# EAGLE design KAC12040_sfe_v0.1 (EAGLE 6.5.2)

## Sheet 1 of 3
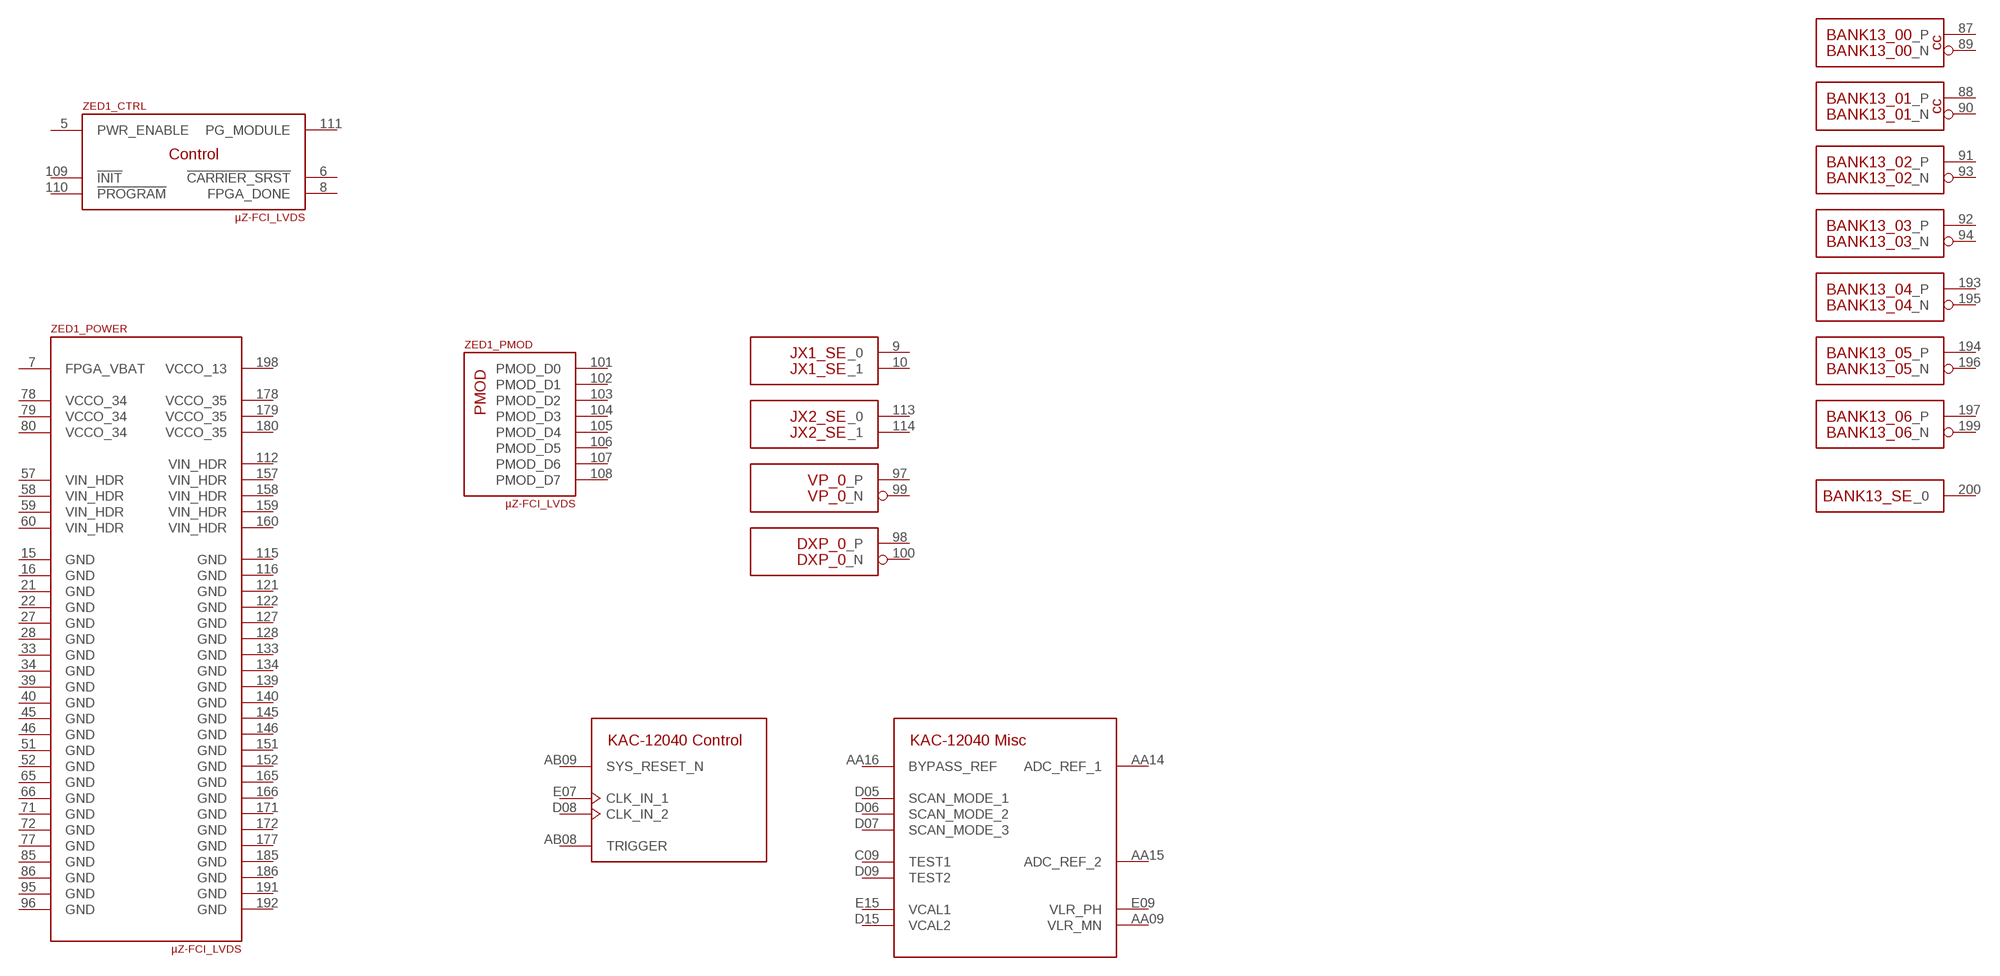
[diagram p0: schematic, sheet 1]

### Parts
U$1  KAC-12040  [KAC-12040-400T4]
ZED1  µZ-FCI_LVDS  [µZ]
Unconnected: U$1.A01(_NC:NC) U$1.A15(_BANK5:LVDS_0_P) U$1.A16(_BANK5:LVDS_1_P) U$1.A17(_BANK5:LVDS_2_P) U$1.A18(_BANK5:LVDS_3_P) U$1.A19(_BANK5:LVDS_4_P) U$1.A20(_BANK5:LVDS_5_P) U$1.A21(_BANK5:LVDS_6_P) U$1.A22(_BANK7:CLK_P) U$1.A23(_BANK7:LVDS_0_P) U$1.A24(_BANK7:LVDS_1_P) U$1.A25(_BANK7:LVDS_2_P) U$1.AA05(_SPI:SPI_CLK) U$1.AA06(_SPI:SPI_EN) U$1.AA07(_SPI:SPI_OUT) U$1.AA08(_SPI:SPI_IN) U$1.AA09(_MISC:VLR_MN) U$1.AA14(_MISC:ADC_REF_1) U$1.AA15(_MISC:ADC_REF_2) U$1.AA16(_MISC:BYPASS_REF) U$1.AA26(_BANK6:LVDS_6_P) U$1.AA27(_BANK6:LVDS_6_N) U$1.AB05(_NC:NC) U$1.AB06(_DIGOUT:FLASH_OUT) U$1.AB07(_DIGOUT:MECH_SHUT_OUT) U$1.AB08(_CTRL:TRIGGER) U$1.AB09(_CTRL:SYS_RESET_N) U$1.AB26(_BANK6:LVDS_5_P) U$1.AB27(_BANK6:LVDS_5_N) U$1.AC09(_NC:NC) U$1.AC15(_BANK4:CLK_P) U$1.AC16(_BANK4:CLK_N) U$1.AC26(_BANK6:LVDS_4_P) U$1.AC27(_BANK6:LVDS_4_N) U$1.AD15(_BANK4:LVDS_0_N) U$1.AD16(_BANK4:LVDS_1_N) U$1.AD17(_BANK4:LVDS_2_N) U$1.AD18(_BANK4:LVDS_3_N) U$1.AD19(_BANK4:LVDS_4_N) U$1.AD20(_BANK4:LVDS_5_N) U$1.AD21(_BANK4:LVDS_6_N) U$1.AD22(_BANK6:CLK_N) U$1.AD23(_BANK6:LVDS_0_N) U$1.AD24(_BANK6:LVDS_1_N) U$1.AD25(_BANK6:LVDS_2_N) U$1.AD26(_BANK6:LVDS_3_P) U$1.AD27(_BANK6:LVDS_3_N) U$1.AE15(_BANK4:LVDS_0_P) U$1.AE16(_BANK4:LVDS_1_P) U$1.AE17(_BANK4:LVDS_2_P) U$1.AE18(_BANK4:LVDS_3_P) U$1.AE19(_BANK4:LVDS_4_P) U$1.AE20(_BANK4:LVDS_5_P) U$1.AE21(_BANK4:LVDS_6_P) U$1.AE22(_BANK6:CLK_P) U$1.AE23(_BANK6:LVDS_0_P) U$1.AE24(_BANK6:LVDS_1_P) U$1.AE25(_BANK6:LVDS_2_P) U$1.B15(_BANK5:LVDS_0_N) U$1.B16(_BANK5:LVDS_1_N) U$1.B17(_BANK5:LVDS_2_N) U$1.B18(_BANK5:LVDS_3_N) U$1.B19(_BANK5:LVDS_4_N) U$1.B20(_BANK5:LVDS_5_N) U$1.B21(_BANK5:LVDS_6_N) U$1.B22(_BANK7:CLK_N) U$1.B23(_BANK7:LVDS_0_N) U$1.B24(_BANK7:LVDS_1_N) U$1.B25(_BANK7:LVDS_2_N) U$1.B26(_BANK7:LVDS_3_N) U$1.B27(_BANK7:LVDS_3_P) U$1.C09(_MISC:TEST1) U$1.C15(_BANK5:CLK_P) U$1.C16(_BANK5:CLK_N) U$1.C26(_BANK7:LVDS_4_N) U$1.C27(_BANK7:LVDS_4_P) U$1.D05(_MISC:SCAN_MODE_1) U$1.D06(_MISC:SCAN_MODE_2) U$1.D07(_MISC:SCAN_MODE_3) U$1.D08(_CTRL:CLK_IN_2) U$1.D09(_MISC:TEST2) U$1.D15(_MISC:VCAL2) U$1.D26(_BANK7:LVDS_5_N) U$1.D27(_BANK7:LVDS_5_P) U$1.E05(_DIGOUT:FRAME_EN_OUT) U$1.E06(_DIGOUT:LINE_EN_OUT) U$1.E07(_CTRL:CLK_IN_1) U$1.E09(_MISC:VLR_PH) U$1.E14(_NC:NC) U$1.E15(_MISC:VCAL1) U$1.E16(_NC:NC) U$1.E26(_BANK7:LVDS_6_N) U$1.E27(_BANK7:LVDS_6_P) ZED1.1(_JTAG:TCK) ZED1.2(_JTAG:TMS) ZED1.3(_JTAG:TDO) ZED1.4(_JTAG:TDI) ZED1.5(_CTRL:PWR_ENABLE) ZED1.6(_CTRL:!CARRIER_SRST) ZED1.8(_CTRL:FPGA_DONE) ZED1.9(JX1_SE:_0) ZED1.10(JX1_SE:_1) ZED1.87(BANK13_00:_P) ZED1.88(BANK13_01:_P) ZED1.89(BANK13_00:_N) ZED1.90(BANK13_01:_N) ZED1.91(BANK13_02:_P) ZED1.92(BANK13_03:_P) ZED1.93(BANK13_02:_N) ZED1.94(BANK13_03:_N) ZED1.97(VP_0:_P) ZED1.98(DXP_0:_P) ZED1.99(VP_0:_N) ZED1.100(DXP_0:_N) ZED1.101(_PMOD:PMOD_D0) ZED1.102(_PMOD:PMOD_D1) ZED1.103(_PMOD:PMOD_D2) ZED1.104(_PMOD:PMOD_D3) ZED1.105(_PMOD:PMOD_D4) ZED1.106(_PMOD:PMOD_D5) ZED1.107(_PMOD:PMOD_D6) ZED1.108(_PMOD:PMOD_D7) ZED1.109(_CTRL:!INIT) ZED1.110(_CTRL:!PROGRAM) ZED1.111(_CTRL:PG_MODULE) ZED1.113(JX2_SE:_0) ZED1.114(JX2_SE:_1) ZED1.193(BANK13_04:_P) ZED1.194(BANK13_05:_P) ZED1.195(BANK13_04:_N) ZED1.196(BANK13_05:_N) ZED1.197(BANK13_06:_P) ZED1.199(BANK13_06:_N) ZED1.200(BANK13_SE:_0)

## Sheet 2 of 3
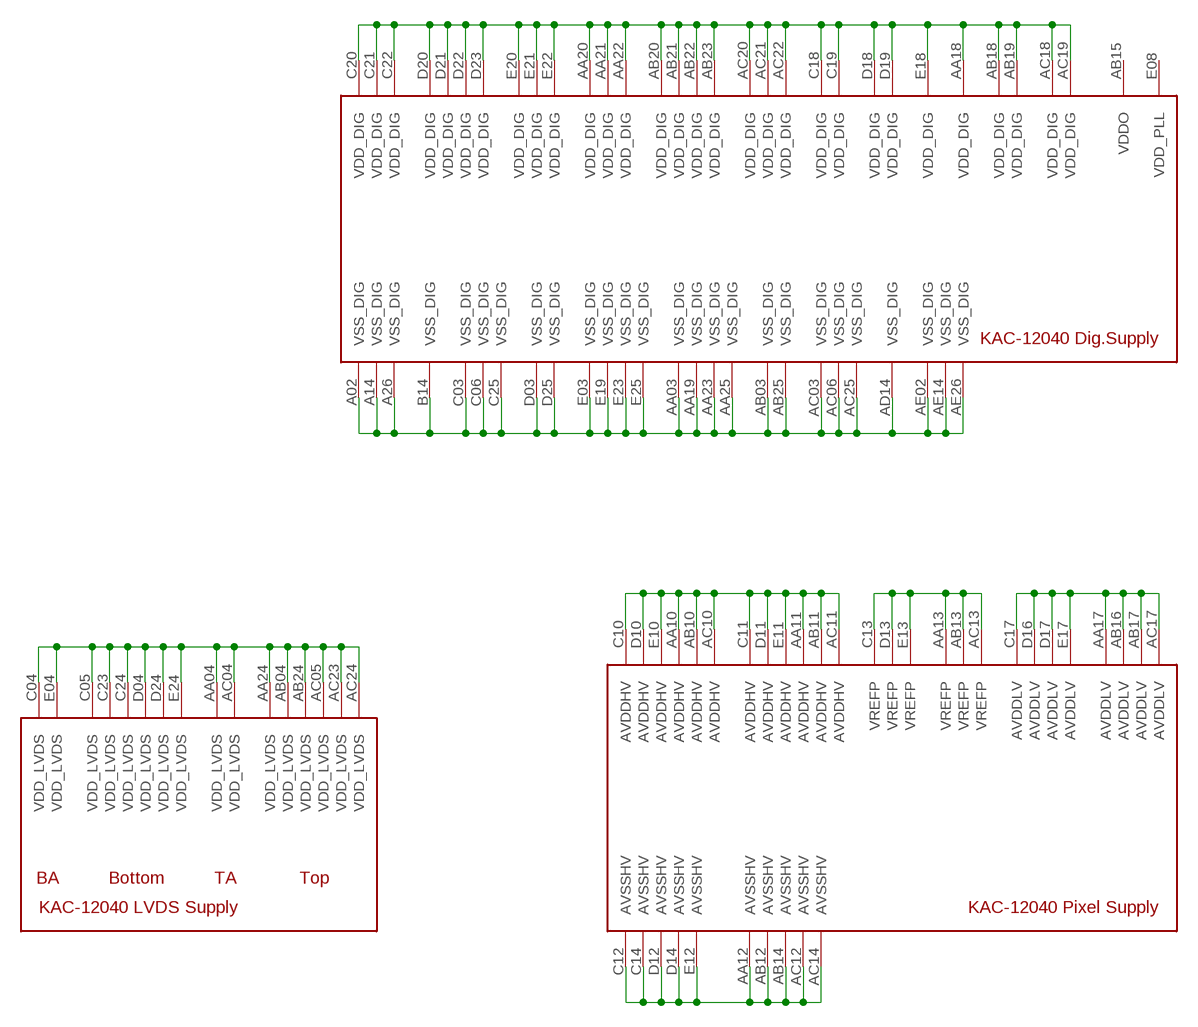
[diagram p1: schematic, sheet 2]

### Nets
N$1: U$1.AA18(_PWR_DIG:VDD_DIG) U$1.AA20(_PWR_DIG:VDD_DIG) U$1.AA21(_PWR_DIG:VDD_DIG) U$1.AA22(_PWR_DIG:VDD_DIG) U$1.AB18(_PWR_DIG:VDD_DIG) U$1.AB19(_PWR_DIG:VDD_DIG) U$1.AB20(_PWR_DIG:VDD_DIG) U$1.AB21(_PWR_DIG:VDD_DIG) U$1.AB22(_PWR_DIG:VDD_DIG) U$1.AB23(_PWR_DIG:VDD_DIG) U$1.AC18(_PWR_DIG:VDD_DIG) U$1.AC19(_PWR_DIG:VDD_DIG) U$1.AC20(_PWR_DIG:VDD_DIG) U$1.AC21(_PWR_DIG:VDD_DIG) U$1.AC22(_PWR_DIG:VDD_DIG) U$1.C18(_PWR_DIG:VDD_DIG) U$1.C19(_PWR_DIG:VDD_DIG) U$1.C20(_PWR_DIG:VDD_DIG) U$1.C21(_PWR_DIG:VDD_DIG) U$1.C22(_PWR_DIG:VDD_DIG) U$1.D18(_PWR_DIG:VDD_DIG) U$1.D19(_PWR_DIG:VDD_DIG) U$1.D20(_PWR_DIG:VDD_DIG) U$1.D21(_PWR_DIG:VDD_DIG) U$1.D22(_PWR_DIG:VDD_DIG) U$1.D23(_PWR_DIG:VDD_DIG) U$1.E18(_PWR_DIG:VDD_DIG) U$1.E20(_PWR_DIG:VDD_DIG) U$1.E21(_PWR_DIG:VDD_DIG) U$1.E22(_PWR_DIG:VDD_DIG)
N$2: U$1.AA13(_PWR_PIXEL:VREFP) U$1.AB13(_PWR_PIXEL:VREFP) U$1.AC13(_PWR_PIXEL:VREFP) U$1.C13(_PWR_PIXEL:VREFP) U$1.D13(_PWR_PIXEL:VREFP) U$1.E13(_PWR_PIXEL:VREFP)
N$3: U$1.A02(_PWR_DIG:VSS_DIG) U$1.A14(_PWR_DIG:VSS_DIG) U$1.A26(_PWR_DIG:VSS_DIG) U$1.AA03(_PWR_DIG:VSS_DIG) U$1.AA19(_PWR_DIG:VSS_DIG) U$1.AA23(_PWR_DIG:VSS_DIG) U$1.AA25(_PWR_DIG:VSS_DIG) U$1.AB03(_PWR_DIG:VSS_DIG) U$1.AB25(_PWR_DIG:VSS_DIG) U$1.AC03(_PWR_DIG:VSS_DIG) U$1.AC06(_PWR_DIG:VSS_DIG) U$1.AC25(_PWR_DIG:VSS_DIG) U$1.AD14(_PWR_DIG:VSS_DIG) U$1.AE02(_PWR_DIG:VSS_DIG) U$1.AE14(_PWR_DIG:VSS_DIG) U$1.AE26(_PWR_DIG:VSS_DIG) U$1.B14(_PWR_DIG:VSS_DIG) U$1.C03(_PWR_DIG:VSS_DIG) U$1.C06(_PWR_DIG:VSS_DIG) U$1.C25(_PWR_DIG:VSS_DIG) U$1.D03(_PWR_DIG:VSS_DIG) U$1.D25(_PWR_DIG:VSS_DIG) U$1.E03(_PWR_DIG:VSS_DIG) U$1.E19(_PWR_DIG:VSS_DIG) U$1.E23(_PWR_DIG:VSS_DIG) U$1.E25(_PWR_DIG:VSS_DIG)
N$4: U$1.AA10(_PWR_PIXEL:AVDDHV) U$1.AA11(_PWR_PIXEL:AVDDHV) U$1.AB10(_PWR_PIXEL:AVDDHV) U$1.AB11(_PWR_PIXEL:AVDDHV) U$1.AC10(_PWR_PIXEL:AVDDHV) U$1.AC11(_PWR_PIXEL:AVDDHV) U$1.C10(_PWR_PIXEL:AVDDHV) U$1.C11(_PWR_PIXEL:AVDDHV) U$1.D10(_PWR_PIXEL:AVDDHV) U$1.D11(_PWR_PIXEL:AVDDHV) U$1.E10(_PWR_PIXEL:AVDDHV) U$1.E11(_PWR_PIXEL:AVDDHV)
N$65: U$1.AA17(_PWR_PIXEL:AVDDLV) U$1.AB16(_PWR_PIXEL:AVDDLV) U$1.AB17(_PWR_PIXEL:AVDDLV) U$1.AC17(_PWR_PIXEL:AVDDLV) U$1.C17(_PWR_PIXEL:AVDDLV) U$1.D16(_PWR_PIXEL:AVDDLV) U$1.D17(_PWR_PIXEL:AVDDLV) U$1.E17(_PWR_PIXEL:AVDDLV)
N$66: U$1.AA12(_PWR_PIXEL:AVSSHV) U$1.AB12(_PWR_PIXEL:AVSSHV) U$1.AB14(_PWR_PIXEL:AVSSHV) U$1.AC12(_PWR_PIXEL:AVSSHV) U$1.AC14(_PWR_PIXEL:AVSSHV) U$1.C12(_PWR_PIXEL:AVSSHV) U$1.C14(_PWR_PIXEL:AVSSHV) U$1.D12(_PWR_PIXEL:AVSSHV) U$1.D14(_PWR_PIXEL:AVSSHV) U$1.E12(_PWR_PIXEL:AVSSHV)
N$67: U$1.AA04(_PWR_LVDS:VDD_LVDS) U$1.AA24(_PWR_LVDS:VDD_LVDS) U$1.AB04(_PWR_LVDS:VDD_LVDS) U$1.AB24(_PWR_LVDS:VDD_LVDS) U$1.AC04(_PWR_LVDS:VDD_LVDS) U$1.AC05(_PWR_LVDS:VDD_LVDS) U$1.AC23(_PWR_LVDS:VDD_LVDS) U$1.AC24(_PWR_LVDS:VDD_LVDS) U$1.C04(_PWR_LVDS:VDD_LVDS) U$1.C05(_PWR_LVDS:VDD_LVDS) U$1.C23(_PWR_LVDS:VDD_LVDS) U$1.C24(_PWR_LVDS:VDD_LVDS) U$1.D04(_PWR_LVDS:VDD_LVDS) U$1.D24(_PWR_LVDS:VDD_LVDS) U$1.E04(_PWR_LVDS:VDD_LVDS) U$1.E24(_PWR_LVDS:VDD_LVDS)

## Sheet 3 of 3
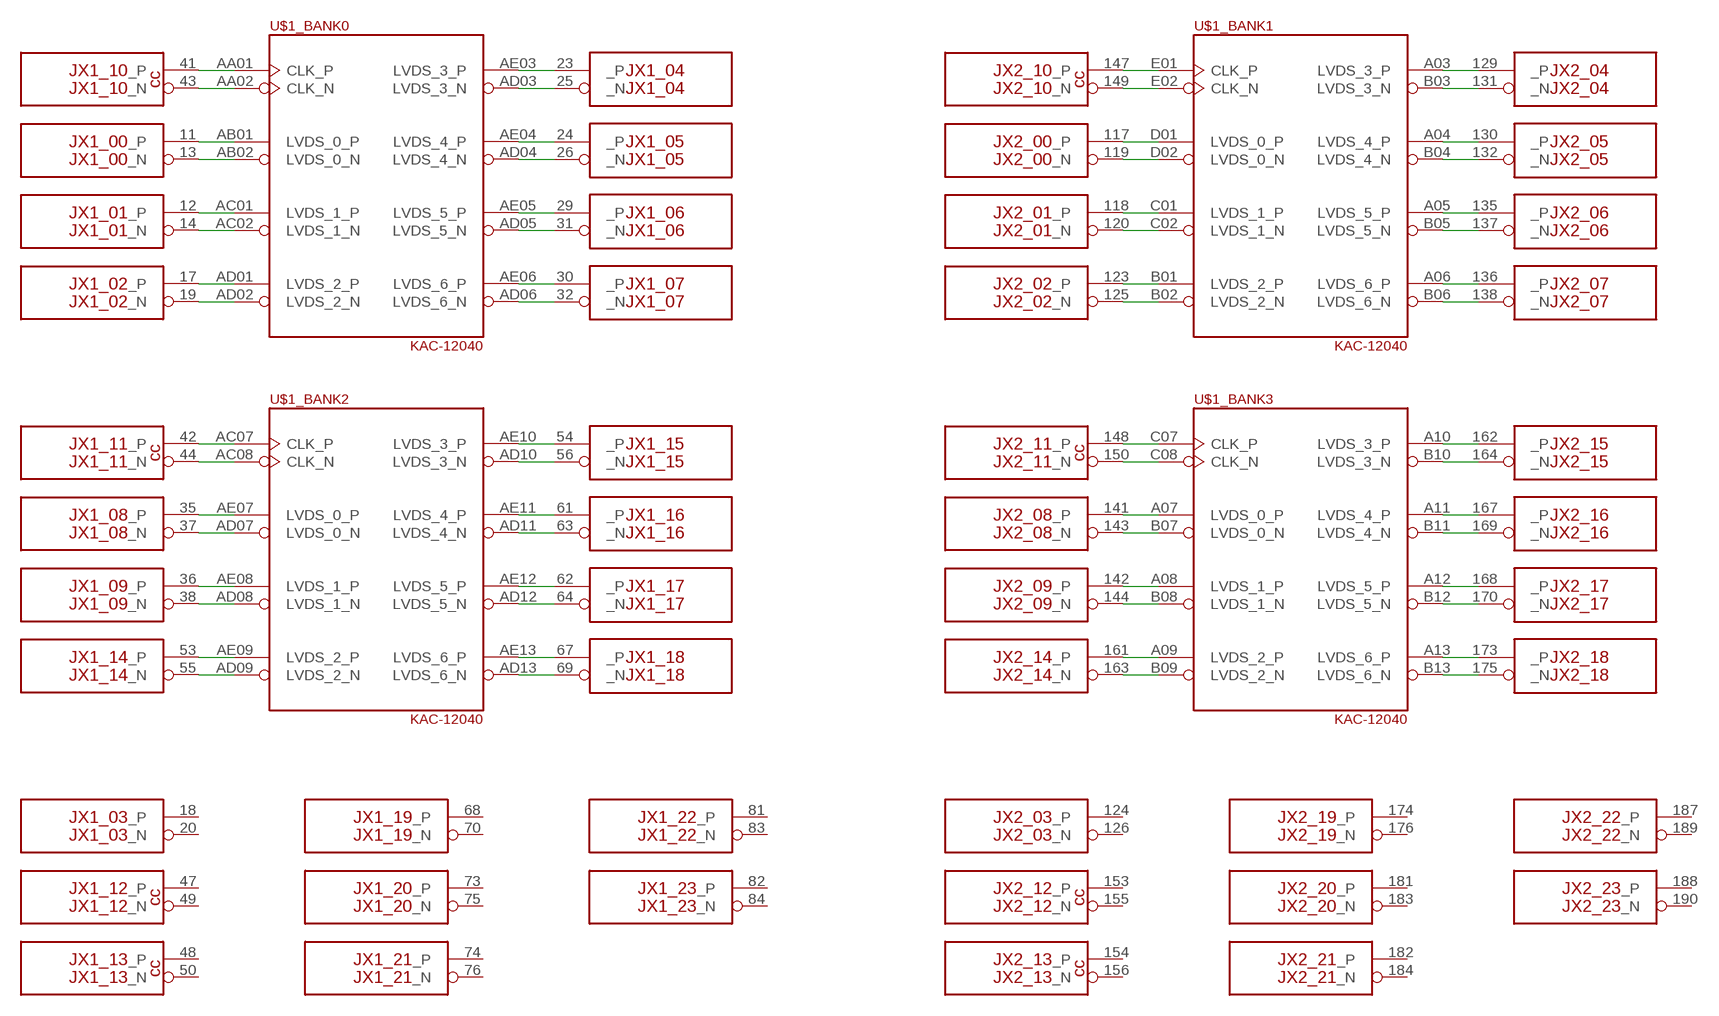
[diagram p2: schematic, sheet 3]

### Nets
C$0_N: U$1.AA02(_BANK0:CLK_N) ZED1.43(JX1_10:_N)
C$0_P: U$1.AA01(_BANK0:CLK_P) ZED1.41(JX1_10:_P)
C$1_N: U$1.E02(_BANK1:CLK_N) ZED1.149(JX2_10:_N)
C$1_P: U$1.E01(_BANK1:CLK_P) ZED1.147(JX2_10:_P)
C$2_N: U$1.AC08(_BANK2:CLK_N) ZED1.44(JX1_11:_N)
C$2_P: U$1.AC07(_BANK2:CLK_P) ZED1.42(JX1_11:_P)
C$3_N: U$1.C08(_BANK3:CLK_N) ZED1.150(JX2_11:_N)
C$3_P: U$1.C07(_BANK3:CLK_P) ZED1.148(JX2_11:_P)
L0$0_N: U$1.AB02(_BANK0:LVDS_0_N) ZED1.13(JX1_00:_N)
L0$0_P: U$1.AB01(_BANK0:LVDS_0_P) ZED1.11(JX1_00:_P)
L0$1_N: U$1.D02(_BANK1:LVDS_0_N) ZED1.119(JX2_00:_N)
L0$1_P: U$1.D01(_BANK1:LVDS_0_P) ZED1.117(JX2_00:_P)
L0$2_N: U$1.AD07(_BANK2:LVDS_0_N) ZED1.37(JX1_08:_N)
L0$2_P: U$1.AE07(_BANK2:LVDS_0_P) ZED1.35(JX1_08:_P)
L0$3_N: U$1.B07(_BANK3:LVDS_0_N) ZED1.143(JX2_08:_N)
L0$3_P: U$1.A07(_BANK3:LVDS_0_P) ZED1.141(JX2_08:_P)
L1$0_N: U$1.AC02(_BANK0:LVDS_1_N) ZED1.14(JX1_01:_N)
L1$0_P: U$1.AC01(_BANK0:LVDS_1_P) ZED1.12(JX1_01:_P)
L1$1_N: U$1.C02(_BANK1:LVDS_1_N) ZED1.120(JX2_01:_N)
L1$1_P: U$1.C01(_BANK1:LVDS_1_P) ZED1.118(JX2_01:_P)
L1$2_N: U$1.AD08(_BANK2:LVDS_1_N) ZED1.38(JX1_09:_N)
L1$2_P: U$1.AE08(_BANK2:LVDS_1_P) ZED1.36(JX1_09:_P)
L1$3_N: U$1.B08(_BANK3:LVDS_1_N) ZED1.144(JX2_09:_N)
L1$3_P: U$1.A08(_BANK3:LVDS_1_P) ZED1.142(JX2_09:_P)
L2$0_N: U$1.AD02(_BANK0:LVDS_2_N) ZED1.19(JX1_02:_N)
L2$0_P: U$1.AD01(_BANK0:LVDS_2_P) ZED1.17(JX1_02:_P)
L2$1_N: U$1.B02(_BANK1:LVDS_2_N) ZED1.125(JX2_02:_N)
L2$1_P: U$1.B01(_BANK1:LVDS_2_P) ZED1.123(JX2_02:_P)
L2$2_N: U$1.AD09(_BANK2:LVDS_2_N) ZED1.55(JX1_14:_N)
L2$2_P: U$1.AE09(_BANK2:LVDS_2_P) ZED1.53(JX1_14:_P)
L2$3_N: U$1.B09(_BANK3:LVDS_2_N) ZED1.163(JX2_14:_N)
L2$3_P: U$1.A09(_BANK3:LVDS_2_P) ZED1.161(JX2_14:_P)
L3$0_N: U$1.AD03(_BANK0:LVDS_3_N) ZED1.25(JX1_04:_N)
L3$0_P: U$1.AE03(_BANK0:LVDS_3_P) ZED1.23(JX1_04:_P)
L3$1_N: U$1.B03(_BANK1:LVDS_3_N) ZED1.131(JX2_04:_N)
L3$1_P: U$1.A03(_BANK1:LVDS_3_P) ZED1.129(JX2_04:_P)
L3$2_N: U$1.AD10(_BANK2:LVDS_3_N) ZED1.56(JX1_15:_N)
L3$2_P: U$1.AE10(_BANK2:LVDS_3_P) ZED1.54(JX1_15:_P)
L3$3_N: U$1.B10(_BANK3:LVDS_3_N) ZED1.164(JX2_15:_N)
L3$3_P: U$1.A10(_BANK3:LVDS_3_P) ZED1.162(JX2_15:_P)
L4$0_N: U$1.AD04(_BANK0:LVDS_4_N) ZED1.26(JX1_05:_N)
L4$0_P: U$1.AE04(_BANK0:LVDS_4_P) ZED1.24(JX1_05:_P)
L4$1_N: U$1.B04(_BANK1:LVDS_4_N) ZED1.132(JX2_05:_N)
L4$1_P: U$1.A04(_BANK1:LVDS_4_P) ZED1.130(JX2_05:_P)
L4$2_N: U$1.AD11(_BANK2:LVDS_4_N) ZED1.63(JX1_16:_N)
L4$2_P: U$1.AE11(_BANK2:LVDS_4_P) ZED1.61(JX1_16:_P)
L4$3_N: U$1.B11(_BANK3:LVDS_4_N) ZED1.169(JX2_16:_N)
L4$3_P: U$1.A11(_BANK3:LVDS_4_P) ZED1.167(JX2_16:_P)
L5$0_N: U$1.AD05(_BANK0:LVDS_5_N) ZED1.31(JX1_06:_N)
L5$0_P: U$1.AE05(_BANK0:LVDS_5_P) ZED1.29(JX1_06:_P)
L5$1_N: U$1.B05(_BANK1:LVDS_5_N) ZED1.137(JX2_06:_N)
L5$1_P: U$1.A05(_BANK1:LVDS_5_P) ZED1.135(JX2_06:_P)
L5$2_N: U$1.AD12(_BANK2:LVDS_5_N) ZED1.64(JX1_17:_N)
L5$2_P: U$1.AE12(_BANK2:LVDS_5_P) ZED1.62(JX1_17:_P)
L5$3_N: U$1.B12(_BANK3:LVDS_5_N) ZED1.170(JX2_17:_N)
L5$3_P: U$1.A12(_BANK3:LVDS_5_P) ZED1.168(JX2_17:_P)
L6$0_N: U$1.AD06(_BANK0:LVDS_6_N) ZED1.32(JX1_07:_N)
L6$0_P: U$1.AE06(_BANK0:LVDS_6_P) ZED1.30(JX1_07:_P)
L6$1_N: U$1.B06(_BANK1:LVDS_6_N) ZED1.138(JX2_07:_N)
L6$1_P: U$1.A06(_BANK1:LVDS_6_P) ZED1.136(JX2_07:_P)
L6$2_N: U$1.AD13(_BANK2:LVDS_6_N) ZED1.69(JX1_18:_N)
L6$2_P: U$1.AE13(_BANK2:LVDS_6_P) ZED1.67(JX1_18:_P)
L6$3_N: U$1.B13(_BANK3:LVDS_6_N) ZED1.175(JX2_18:_N)
L6$3_P: U$1.A13(_BANK3:LVDS_6_P) ZED1.173(JX2_18:_P)
Unconnected: ZED1.18(JX1_03:_P) ZED1.20(JX1_03:_N) ZED1.47(JX1_12:_P) ZED1.48(JX1_13:_P) ZED1.49(JX1_12:_N) ZED1.50(JX1_13:_N) ZED1.68(JX1_19:_P) ZED1.70(JX1_19:_N) ZED1.73(JX1_20:_P) ZED1.74(JX1_21:_P) ZED1.75(JX1_20:_N) ZED1.76(JX1_21:_N) ZED1.81(JX1_22:_P) ZED1.82(JX1_23:_P) ZED1.83(JX1_22:_N) ZED1.84(JX1_23:_N) ZED1.124(JX2_03:_P) ZED1.126(JX2_03:_N) ZED1.153(JX2_12:_P) ZED1.154(JX2_13:_P) ZED1.155(JX2_12:_N) ZED1.156(JX2_13:_N) ZED1.174(JX2_19:_P) ZED1.176(JX2_19:_N) ZED1.181(JX2_20:_P) ZED1.182(JX2_21:_P) ZED1.183(JX2_20:_N) ZED1.184(JX2_21:_N) ZED1.187(JX2_22:_P) ZED1.188(JX2_23:_P) ZED1.189(JX2_22:_N) ZED1.190(JX2_23:_N)

## Power pins joined to a net without a drawn wire
FPGA_VBAT: ZED1.7(_POWER:FPGA_VBAT)
GND: ZED1.15(_POWER:GND) ZED1.16(_POWER:GND) ZED1.21(_POWER:GND) ZED1.22(_POWER:GND) ZED1.27(_POWER:GND) ZED1.28(_POWER:GND) ZED1.33(_POWER:GND) ZED1.34(_POWER:GND) ZED1.39(_POWER:GND) ZED1.40(_POWER:GND) ZED1.45(_POWER:GND) ZED1.46(_POWER:GND) ZED1.51(_POWER:GND) ZED1.52(_POWER:GND) ZED1.65(_POWER:GND) ZED1.66(_POWER:GND) ZED1.71(_POWER:GND) ZED1.72(_POWER:GND) ZED1.77(_POWER:GND) ZED1.85(_POWER:GND) ZED1.86(_POWER:GND) ZED1.95(_POWER:GND) ZED1.96(_POWER:GND) ZED1.115(_POWER:GND) ZED1.116(_POWER:GND) ZED1.121(_POWER:GND) ZED1.122(_POWER:GND) ZED1.127(_POWER:GND) ZED1.128(_POWER:GND) ZED1.133(_POWER:GND) ZED1.134(_POWER:GND) ZED1.139(_POWER:GND) ZED1.140(_POWER:GND) ZED1.145(_POWER:GND) ZED1.146(_POWER:GND) ZED1.151(_POWER:GND) ZED1.152(_POWER:GND) ZED1.165(_POWER:GND) ZED1.166(_POWER:GND) ZED1.171(_POWER:GND) ZED1.172(_POWER:GND) ZED1.177(_POWER:GND) ZED1.185(_POWER:GND) ZED1.186(_POWER:GND) ZED1.191(_POWER:GND) ZED1.192(_POWER:GND)
VCCO_13: ZED1.198(_POWER:VCCO_13)
VCCO_34: ZED1.78(_POWER:VCCO_34) ZED1.79(_POWER:VCCO_34) ZED1.80(_POWER:VCCO_34)
VCCO_35: ZED1.178(_POWER:VCCO_35) ZED1.179(_POWER:VCCO_35) ZED1.180(_POWER:VCCO_35)
VDD_PLL: U$1.E08(_PWR_DIG:VDD_PLL)
VDDO: U$1.AB15(_PWR_DIG:VDDO)
VIN_HDR: ZED1.57(_POWER:VIN_HDR) ZED1.58(_POWER:VIN_HDR) ZED1.59(_POWER:VIN_HDR) ZED1.60(_POWER:VIN_HDR) ZED1.112(_POWER:VIN_HDR) ZED1.157(_POWER:VIN_HDR) ZED1.158(_POWER:VIN_HDR) ZED1.159(_POWER:VIN_HDR) ZED1.160(_POWER:VIN_HDR)

## Library data of the parts
U$1 = KAC-12040:KAC-12040
ZED1 = microzed:µZ-FCI

## Board
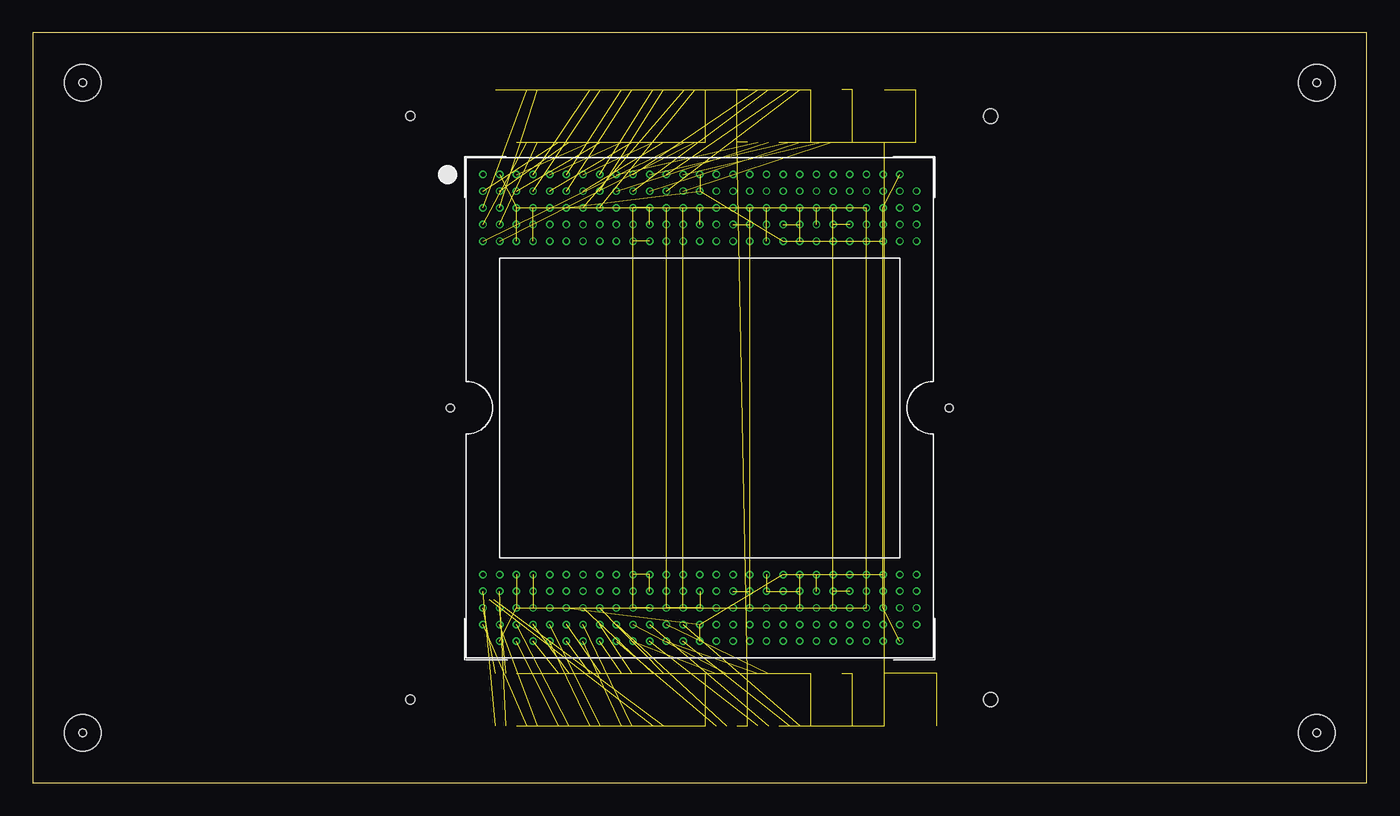
[diagram p3: board, top side]
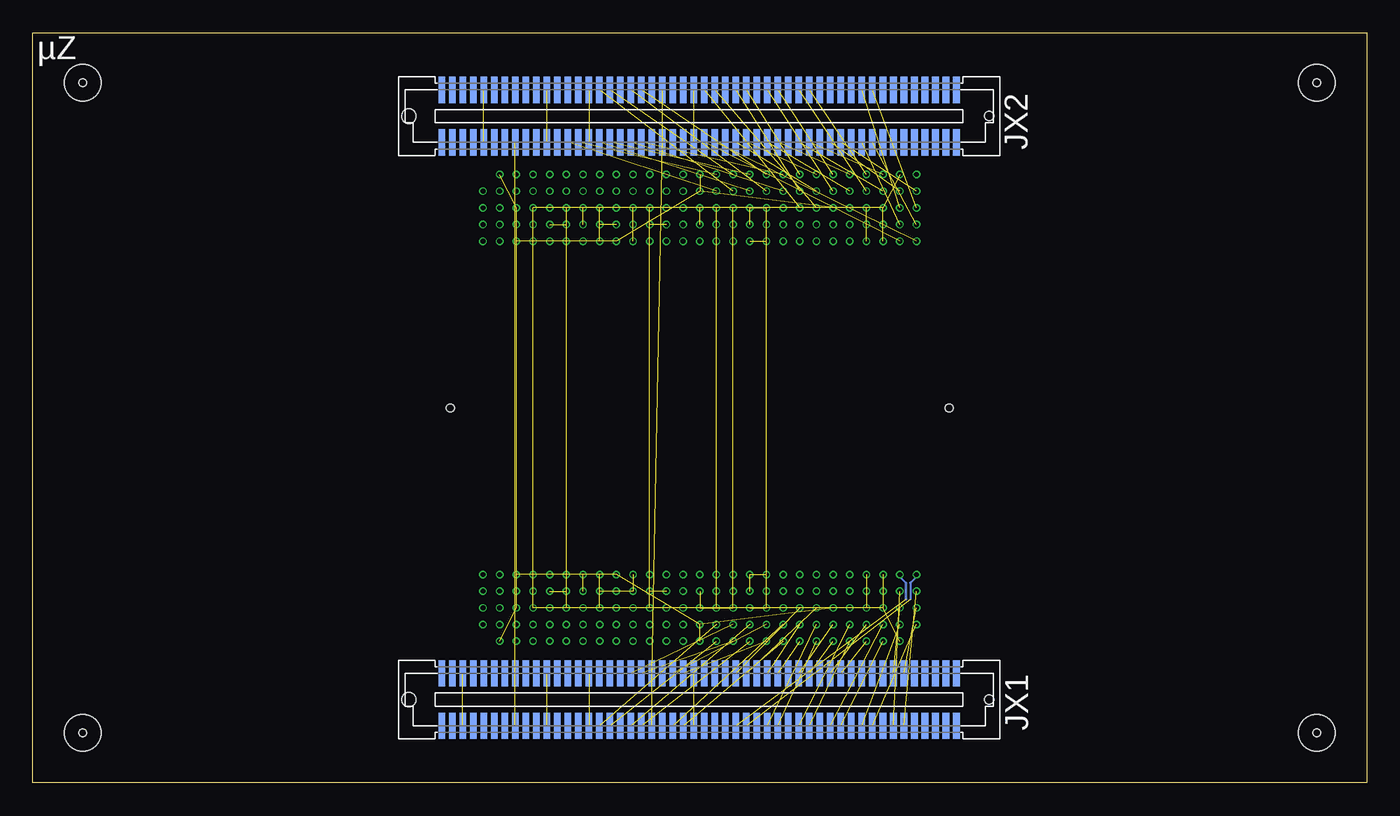
[diagram p4: board, bottom side, seen from below]

Size 101.6 x 57.15 mm. Coordinates in mm from the lower left corner, seen from the top.
Outline: 0,0 101.6,0 101.6,57.15 0,57.15 0,0
Copper layers (1+2*15+16): Top 0.035559375mm / dielectric 0.17018125mm / Route2 0.01778125mm / dielectric 47mil / Route15 0.0356mm / dielectric 0.2007mm / Bottom 0.0356mm
Design rules "LaenPCBOrder4L": minimum track width 5mil, minimum drill 10mil, track to track 5mil, track to pad 5mil, pad to pad 5mil, via to via 5mil, smd to smd 5mil, copper to edge 15mil, drill to drill 5mil, minimum pad ring 4mil, minimum via ring 4mil, stop-mask expansion 4mil, vias tented up to drill 0mil, thermal gap 8mil
Holes 0.6 mm at 3.81,3.81 97.79,3.81 97.79,53.34 3.81,53.34

### Footprints (pad centres in the part's own frame; a part is rotated, then mirrored left to right if it is on the bottom)
KAC-12040-400T4 = drill 0.361: A01 -16.51,17.78; A02 -15.24,17.78; A03 -13.97,17.78; A04 -12.7,17.78; A05 -11.43,17.78; A06 -10.16,17.78; A07 -8.89,17.78; A08 -7.62,17.78; A09 -6.35,17.78; A10 -5.08,17.78; A11 -3.81,17.78; A12 -2.54,17.78; A13 -1.27,17.78; A14 0,17.78; A15 1.27,17.78; A16 2.54,17.78; A17 3.81,17.78; A18 5.08,17.78; A19 6.35,17.78; A20 7.62,17.78; A21 8.89,17.78; A22 10.16,17.78; A23 11.43,17.78; A24 12.7,17.78; A25 13.97,17.78; A26 15.24,17.78; AA01 -16.51,-12.7; AA02 -15.24,-12.7; AA03 -13.97,-12.7; AA04 -12.7,-12.7; AA05 -11.43,-12.7; AA06 -10.16,-12.7; AA07 -8.89,-12.7; AA08 -7.62,-12.7; AA09 -6.35,-12.7; AA10 -5.08,-12.7; AA11 -3.81,-12.7; AA12 -2.54,-12.7; AA13 -1.27,-12.7; AA14 0,-12.7; AA15 1.27,-12.7; AA16 2.54,-12.7; AA17 3.81,-12.7; AA18 5.08,-12.7; AA19 6.35,-12.7; AA20 7.62,-12.7; AA21 8.89,-12.7; AA22 10.16,-12.7; AA23 11.43,-12.7; AA24 12.7,-12.7; AA25 13.97,-12.7; AA26 15.24,-12.7; AA27 16.51,-12.7; AB01 -16.51,-13.97; AB02 -15.24,-13.97; AB03 -13.97,-13.97; AB04 -12.7,-13.97; AB05 -11.43,-13.97; AB06 -10.16,-13.97; AB07 -8.89,-13.97; AB08 -7.62,-13.97; AB09 -6.35,-13.97; AB10 -5.08,-13.97; AB11 -3.81,-13.97; AB12 -2.54,-13.97; AB13 -1.27,-13.97; AB14 0,-13.97; AB15 1.27,-13.97; AB16 2.54,-13.97; AB17 3.81,-13.97; AB18 5.08,-13.97; AB19 6.35,-13.97; AB20 7.62,-13.97; AB21 8.89,-13.97; AB22 10.16,-13.97; AB23 11.43,-13.97; AB24 12.7,-13.97; AB25 13.97,-13.97; AB26 15.24,-13.97; AB27 16.51,-13.97; AC01 -16.51,-15.24; AC02 -15.24,-15.24; AC03 -13.97,-15.24; AC04 -12.7,-15.24; AC05 -11.43,-15.24; AC06 -10.16,-15.24; AC07 -8.89,-15.24; AC08 -7.62,-15.24; AC09 -6.35,-15.24; AC10 -5.08,-15.24; AC11 -3.81,-15.24; AC12 -2.54,-15.24; AC13 -1.27,-15.24; AC14 0,-15.24; AC15 1.27,-15.24; AC16 2.54,-15.24; AC17 3.81,-15.24; AC18 5.08,-15.24; AC19 6.35,-15.24; AC20 7.62,-15.24; AC21 8.89,-15.24; AC22 10.16,-15.24; AC23 11.43,-15.24; AC24 12.7,-15.24; AC25 13.97,-15.24; AC26 15.24,-15.24; AC27 16.51,-15.24; AD01 -16.51,-16.51; AD02 -15.24,-16.51; AD03 -13.97,-16.51; AD04 -12.7,-16.51; AD05 -11.43,-16.51; AD06 -10.16,-16.51; AD07 -8.89,-16.51; AD08 -7.62,-16.51; AD09 -6.35,-16.51; AD10 -5.08,-16.51; AD11 -3.81,-16.51; AD12 -2.54,-16.51; AD13 -1.27,-16.51; AD14 0,-16.51; AD15 1.27,-16.51; AD16 2.54,-16.51; AD17 3.81,-16.51; AD18 5.08,-16.51; AD19 6.35,-16.51; AD20 7.62,-16.51; AD21 8.89,-16.51; AD22 10.16,-16.51; AD23 11.43,-16.51; AD24 12.7,-16.51; AD25 13.97,-16.51; AD26 15.24,-16.51; AD27 16.51,-16.51; AE02 -15.24,-17.78; AE03 -13.97,-17.78; AE04 -12.7,-17.78; AE05 -11.43,-17.78; AE06 -10.16,-17.78; AE07 -8.89,-17.78; AE08 -7.62,-17.78; AE09 -6.35,-17.78; AE10 -5.08,-17.78; AE11 -3.81,-17.78; AE12 -2.54,-17.78; AE13 -1.27,-17.78; AE14 0,-17.78; AE15 1.27,-17.78; AE16 2.54,-17.78; AE17 3.81,-17.78; AE18 5.08,-17.78; AE19 6.35,-17.78; AE20 7.62,-17.78; AE21 8.89,-17.78; AE22 10.16,-17.78; AE23 11.43,-17.78; AE24 12.7,-17.78; AE25 13.97,-17.78; AE26 15.24,-17.78; B01 -16.51,16.51; B02 -15.24,16.51; B03 -13.97,16.51; B04 -12.7,16.51; B05 -11.43,16.51; B06 -10.16,16.51; B07 -8.89,16.51; B08 -7.62,16.51; B09 -6.35,16.51; B10 -5.08,16.51; B11 -3.81,16.51; B12 -2.54,16.51; B13 -1.27,16.51; B14 0,16.51; B15 1.27,16.51; B16 2.54,16.51; B17 3.81,16.51; B18 5.08,16.51; B19 6.35,16.51; B20 7.62,16.51; B21 8.89,16.51; B22 10.16,16.51; B23 11.43,16.51; B24 12.7,16.51; B25 13.97,16.51; B26 15.24,16.51; B27 16.51,16.51; C01 -16.51,15.24; C02 -15.24,15.24; C03 -13.97,15.24; C04 -12.7,15.24; C05 -11.43,15.24; C06 -10.16,15.24; C07 -8.89,15.24; C08 -7.62,15.24; C09 -6.35,15.24; C10 -5.08,15.24; C11 -3.81,15.24; C12 -2.54,15.24; C13 -1.27,15.24; C14 0,15.24; C15 1.27,15.24; C16 2.54,15.24; C17 3.81,15.24; C18 5.08,15.24; C19 6.35,15.24; C20 7.62,15.24; C21 8.89,15.24; C22 10.16,15.24; C23 11.43,15.24; C24 12.7,15.24; C25 13.97,15.24; C26 15.24,15.24; C27 16.51,15.24; D01 -16.51,13.97; D02 -15.24,13.97; D03 -13.97,13.97; D04 -12.7,13.97; D05 -11.43,13.97; D06 -10.16,13.97; D07 -8.89,13.97; D08 -7.62,13.97; D09 -6.35,13.97; D10 -5.08,13.97; D11 -3.81,13.97; D12 -2.54,13.97; D13 -1.27,13.97; D14 0,13.97; D15 1.27,13.97; D16 2.54,13.97; D17 3.81,13.97; D18 5.08,13.97; D19 6.35,13.97; D20 7.62,13.97; D21 8.89,13.97; D22 10.16,13.97; D23 11.43,13.97; D24 12.7,13.97; D25 13.97,13.97; D26 15.24,13.97; D27 16.51,13.97; E01 -16.51,12.7; E02 -15.24,12.7; E03 -13.97,12.7; E04 -12.7,12.7; E05 -11.43,12.7; E06 -10.16,12.7; E07 -8.89,12.7; E08 -7.62,12.7; E09 -6.35,12.7; E10 -5.08,12.7; E11 -3.81,12.7; E12 -2.54,12.7; E13 -1.27,12.7; E14 0,12.7; E15 1.27,12.7; E16 2.54,12.7; E17 3.81,12.7; E18 5.08,12.7; E19 6.35,12.7; E20 7.62,12.7; E21 8.89,12.7; E22 10.16,12.7; E23 11.43,12.7; E24 12.7,12.7; E25 13.97,12.7; E26 15.24,12.7; E27 16.51,12.7 | hole 0.6: -19,0; 19,0
µZ = smd 0.5 x 2: 1 70.351,4.349; 2 70.351,8.349; 3 69.551,4.349; 4 69.551,8.349; 5 68.751,4.349; 6 68.751,8.349; 7 67.951,4.349; 8 67.951,8.349; 9 67.151,4.349; 10 67.151,8.349; 11 66.351,4.349; 12 66.351,8.349; 13 65.551,4.349; 14 65.551,8.349; 15 64.751,4.349; 16 64.751,8.349; 17 63.951,4.349; 18 63.951,8.349; 19 63.151,4.349; 20 63.151,8.349; 21 62.351,4.349; 22 62.351,8.349; 23 61.551,4.349; 24 61.551,8.349; 25 60.751,4.349; 26 60.751,8.349; 27 59.951,4.349; 28 59.951,8.349; 29 59.151,4.349; 30 59.151,8.349; 31 58.351,4.349; 32 58.351,8.349; 33 57.551,4.349; 34 57.551,8.349; 35 56.751,4.349; 36 56.751,8.349; 37 55.951,4.349; 38 55.951,8.349; 39 55.151,4.349; 40 55.151,8.349; 41 54.351,4.349; 42 54.351,8.349; 43 53.551,4.349; 44 53.551,8.349; 45 52.751,4.349; 46 52.751,8.349; 47 51.951,4.349; 48 51.951,8.349; 49 51.151,4.349; 50 51.151,8.349; 51 50.351,4.349; 52 50.351,8.349; 53 49.551,4.349; 54 49.551,8.349; 55 48.751,4.349; 56 48.751,8.349; 57 47.951,4.349; 58 47.951,8.349; 59 47.151,4.349; 60 47.151,8.349; 61 46.351,4.349; 62 46.351,8.349; 63 45.551,4.349; 64 45.551,8.349; 65 44.751,4.349; 66 44.751,8.349; 67 43.951,4.349; 68 43.951,8.349; 69 43.151,4.349; 70 43.151,8.349; 71 42.351,4.349; 72 42.351,8.349; 73 41.551,4.349; 74 41.551,8.349; 75 40.751,4.349; 76 40.751,8.349; 77 39.951,4.349; 78 39.951,8.349; 79 39.151,4.349; 80 39.151,8.349; 81 38.351,4.349; 82 38.351,8.349; 83 37.551,4.349; 84 37.551,8.349; 85 36.751,4.349; 86 36.751,8.349; 87 35.951,4.349; 88 35.951,8.349; 89 35.151,4.349; 90 35.151,8.349; 91 34.351,4.349; 92 34.351,8.349; 93 33.551,4.349; 94 33.551,8.349; 95 32.751,4.349; 96 32.751,8.349; 97 31.951,4.349; 98 31.951,8.349; 99 31.151,4.349; 100 31.151,8.349; 101 70.351,48.801; 102 70.351,52.801; 103 69.551,48.801; 104 69.551,52.801; 105 68.751,48.801; 106 68.751,52.801; 107 67.951,48.801; 108 67.951,52.801; 109 67.151,48.801; 110 67.151,52.801; 111 66.351,48.801; 112 66.351,52.801; 113 65.551,48.801; 114 65.551,52.801; 115 64.751,48.801; 116 64.751,52.801; 117 63.951,48.801; 118 63.951,52.801; 119 63.151,48.801; 120 63.151,52.801; 121 62.351,48.801; 122 62.351,52.801; 123 61.551,48.801; 124 61.551,52.801; 125 60.751,48.801; 126 60.751,52.801; 127 59.951,48.801; 128 59.951,52.801; 129 59.151,48.801; 130 59.151,52.801; 131 58.351,48.801; 132 58.351,52.801; 133 57.551,48.801; 134 57.551,52.801; 135 56.751,48.801; 136 56.751,52.801; 137 55.951,48.801; 138 55.951,52.801; 139 55.151,48.801; 140 55.151,52.801; 141 54.351,48.801; 142 54.351,52.801; 143 53.551,48.801; 144 53.551,52.801; 145 52.751,48.801; 146 52.751,52.801; 147 51.951,48.801; 148 51.951,52.801; 149 51.151,48.801; 150 51.151,52.801; 151 50.351,48.801; 152 50.351,52.801; 153 49.551,48.801; 154 49.551,52.801; 155 48.751,48.801; 156 48.751,52.801; 157 47.951,48.801; 158 47.951,52.801; 159 47.151,48.801; 160 47.151,52.801; 161 46.351,48.801; 162 46.351,52.801; 163 45.551,48.801; 164 45.551,52.801; 165 44.751,48.801; 166 44.751,52.801; 167 43.951,48.801; 168 43.951,52.801; 169 43.151,48.801; 170 43.151,52.801; 171 42.351,48.801; 172 42.351,52.801; 173 41.551,48.801; 174 41.551,52.801; 175 40.751,48.801; 176 40.751,52.801; 177 39.951,48.801; 178 39.951,52.801; 179 39.151,48.801; 180 39.151,52.801; 181 38.351,48.801; 182 38.351,52.801; 183 37.551,48.801; 184 37.551,52.801; 185 36.751,48.801; 186 36.751,52.801; 187 35.951,48.801; 188 35.951,52.801; 189 35.151,48.801; 190 35.151,52.801; 191 34.351,48.801; 192 34.351,52.801; 193 33.551,48.801; 194 33.551,52.801; 195 32.751,48.801; 196 32.751,52.801; 197 31.951,48.801; 198 31.951,52.801; 199 31.151,48.801; 200 31.151,52.801 | hole 2.8: 3.81,3.81; 3.81,53.34; 97.79,3.81; 97.79,53.34 | hole 1.1: 28.651,6.349; 28.651,50.801 | hole 0.7: 72.851,6.349; 72.851,50.801

### Placement (x,y rotation side)
U$1  50.8,28.57 0 top
ZED1  101.6,0 0 bottom

### Tracks (layer width: path | path; a pad name or v marks a point on that pad's centre or on a via)
C$0_N  (1 unrouted)
  Bottom 0.203: U$1.AA02 35.56,15.71 35.09,15.24 35.09,13.97
C$0_P  (1 unrouted)
  Bottom 0.152: 34.76,15.24 34.76,13.97
  Bottom 0.203: U$1.AA01 34.29,15.71 34.76,15.24
C$1_N  (1 unrouted)
C$1_P  (1 unrouted)
C$2_N  (1 unrouted)
C$2_P  (1 unrouted)
C$3_N  (1 unrouted)
C$3_P  (1 unrouted)
GND  (45 unrouted)
L0$0_N  (1 unrouted)
L0$0_P  (1 unrouted)
L0$1_N  (1 unrouted)
L0$1_P  (1 unrouted)
L0$2_N  (1 unrouted)
L0$2_P  (1 unrouted)
L0$3_N  (1 unrouted)
L0$3_P  (1 unrouted)
L1$0_N  (1 unrouted)
L1$0_P  (1 unrouted)
L1$1_N  (1 unrouted)
L1$1_P  (1 unrouted)
L1$2_N  (1 unrouted)
L1$2_P  (1 unrouted)
L1$3_N  (1 unrouted)
L1$3_P  (1 unrouted)
L2$0_N  (1 unrouted)
L2$0_P  (1 unrouted)
L2$1_N  (1 unrouted)
L2$1_P  (1 unrouted)
L2$2_N  (1 unrouted)
L2$2_P  (1 unrouted)
L2$3_N  (1 unrouted)
L2$3_P  (1 unrouted)
L3$0_N  (1 unrouted)
L3$0_P  (1 unrouted)
L3$1_N  (1 unrouted)
L3$1_P  (1 unrouted)
L3$2_N  (1 unrouted)
L3$2_P  (1 unrouted)
L3$3_N  (1 unrouted)
L3$3_P  (1 unrouted)
L4$0_N  (1 unrouted)
L4$0_P  (1 unrouted)
L4$1_N  (1 unrouted)
L4$1_P  (1 unrouted)
L4$2_N  (1 unrouted)
L4$2_P  (1 unrouted)
L4$3_N  (1 unrouted)
L4$3_P  (1 unrouted)
L5$0_N  (1 unrouted)
L5$0_P  (1 unrouted)
L5$1_N  (1 unrouted)
L5$1_P  (1 unrouted)
L5$2_N  (1 unrouted)
L5$2_P  (1 unrouted)
L5$3_N  (1 unrouted)
L5$3_P  (1 unrouted)
L6$0_N  (1 unrouted)
L6$0_P  (1 unrouted)
L6$1_N  (1 unrouted)
L6$1_P  (1 unrouted)
L6$2_N  (1 unrouted)
L6$2_P  (1 unrouted)
L6$3_N  (1 unrouted)
L6$3_P  (1 unrouted)
N$1  (29 unrouted)
N$2  (5 unrouted)
N$3  (25 unrouted)
N$4  (11 unrouted)
N$65  (7 unrouted)
N$66  (9 unrouted)
N$67  (15 unrouted)
VCCO_34  (2 unrouted)
VCCO_35  (2 unrouted)
VIN_HDR  (8 unrouted)